# Altium schematic sheet accelerometer.SchDoc
size A4
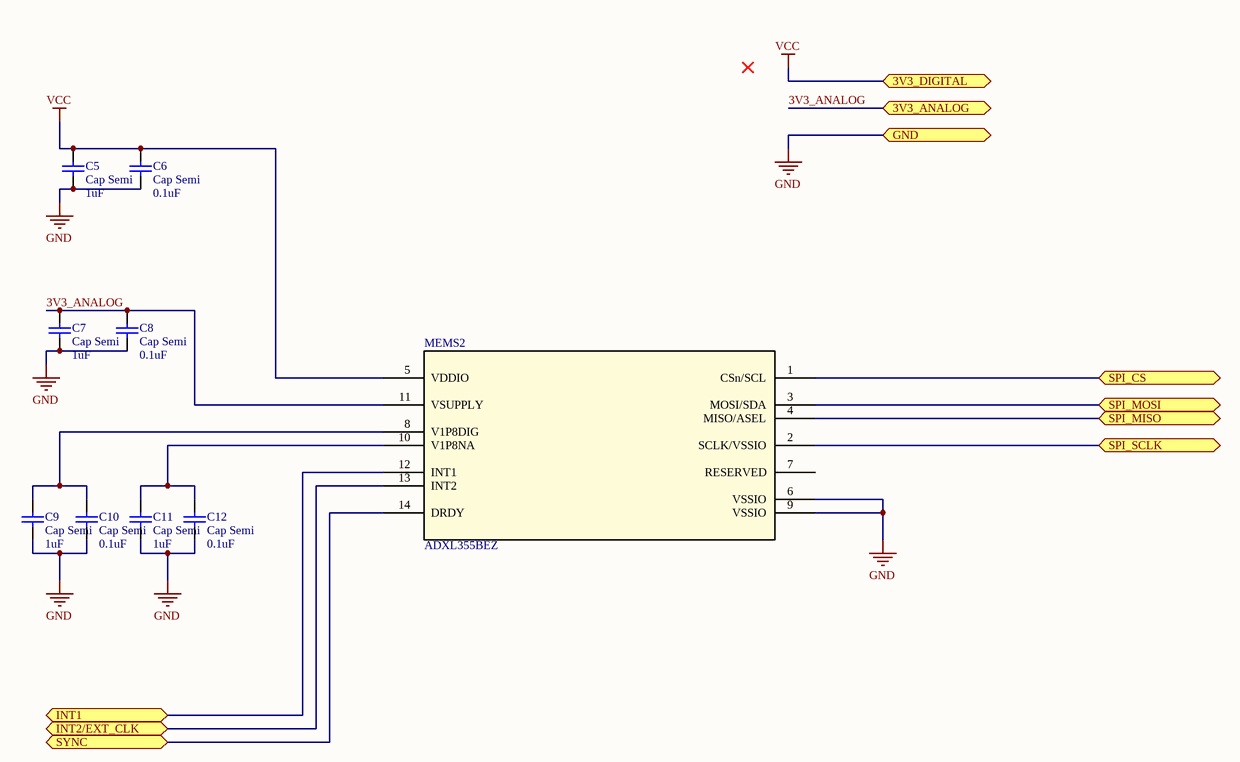
[diagram p0: accelerometer.SchDoc]

## Parts
C5  Cap Semi  value 1uF  [C1210]
C6  Cap Semi  value 0.1uF  [C1206]
C7  Cap Semi  value 1uF  [C1210]
C8  Cap Semi  value 0.1uF  [C1206]
C9  Cap Semi  value 1uF  [C1210]
C10  Cap Semi  value 0.1uF  [C1206]
C11  Cap Semi  value 1uF  [C1210]
C12  Cap Semi  value 0.1uF  [C1206]
MEMS2  ADXL355BEZ  [E_14_1]

## Ports
3V3_ANALOG, 3V3_DIGITAL, GND, INT1, INT2/EXT_CLK, SPI_CS, SPI_MISO, SPI_MOSI, SPI_SCLK, SYNC

## Nets
GND: C5.1 C6.1 C7.1 C8.1 C9.1 C10.1 C11.1 C12.1 MEMS2.6(VSSIO) MEMS2.9(VSSIO) ; port GND
VCC: C5.2 C6.2 MEMS2.5(VDDIO) ; port 3V3_DIGITAL
3V3_ANALOG: C7.2 C8.2 MEMS2.11(VSUPPLY) ; port 3V3_ANALOG
INT1: MEMS2.12(INT1) ; port INT1
INT2/EXT_CLK: MEMS2.13(INT2) ; port INT2/EXT_CLK
SPI_CS: MEMS2.1(CSn/SCL) ; port SPI_CS
SPI_MISO: MEMS2.4(MISO/ASEL) ; port SPI_MISO
SPI_MOSI: MEMS2.3(MOSI/SDA) ; port SPI_MOSI
SPI_SCLK: MEMS2.2(SCLK/VSSIO) ; port SPI_SCLK
SYNC: MEMS2.14(DRDY) ; port SYNC
NetC9_2: C9.2 C10.2 MEMS2.8(V1P8DIG)
NetC11_2: C11.2 C12.2 MEMS2.10(V1P8NA)

Not connected (* = marked no-connect by the designer): MEMS2 7(RESERVED)

## Library data of the parts
C5-C12 = Cap Semi: Capacitor (Semiconductor SIM Model); Published: 8-Jun-2000; LatestRevisionDate: 29-May-2009; LatestRevisionNote: IPC-7351 Footprint Added.; PackageReference: C1206; Publisher: Altium Limited; PackageDescription: Chip Capacitor
MEMS2 = ADXL355BEZ: Imported; Value: Value; Type: Type; RefDes: RefDes